# Altium schematic sheet esquematico.SchDoc
size A4; SheetNumber: 2; SheetTotal: 3
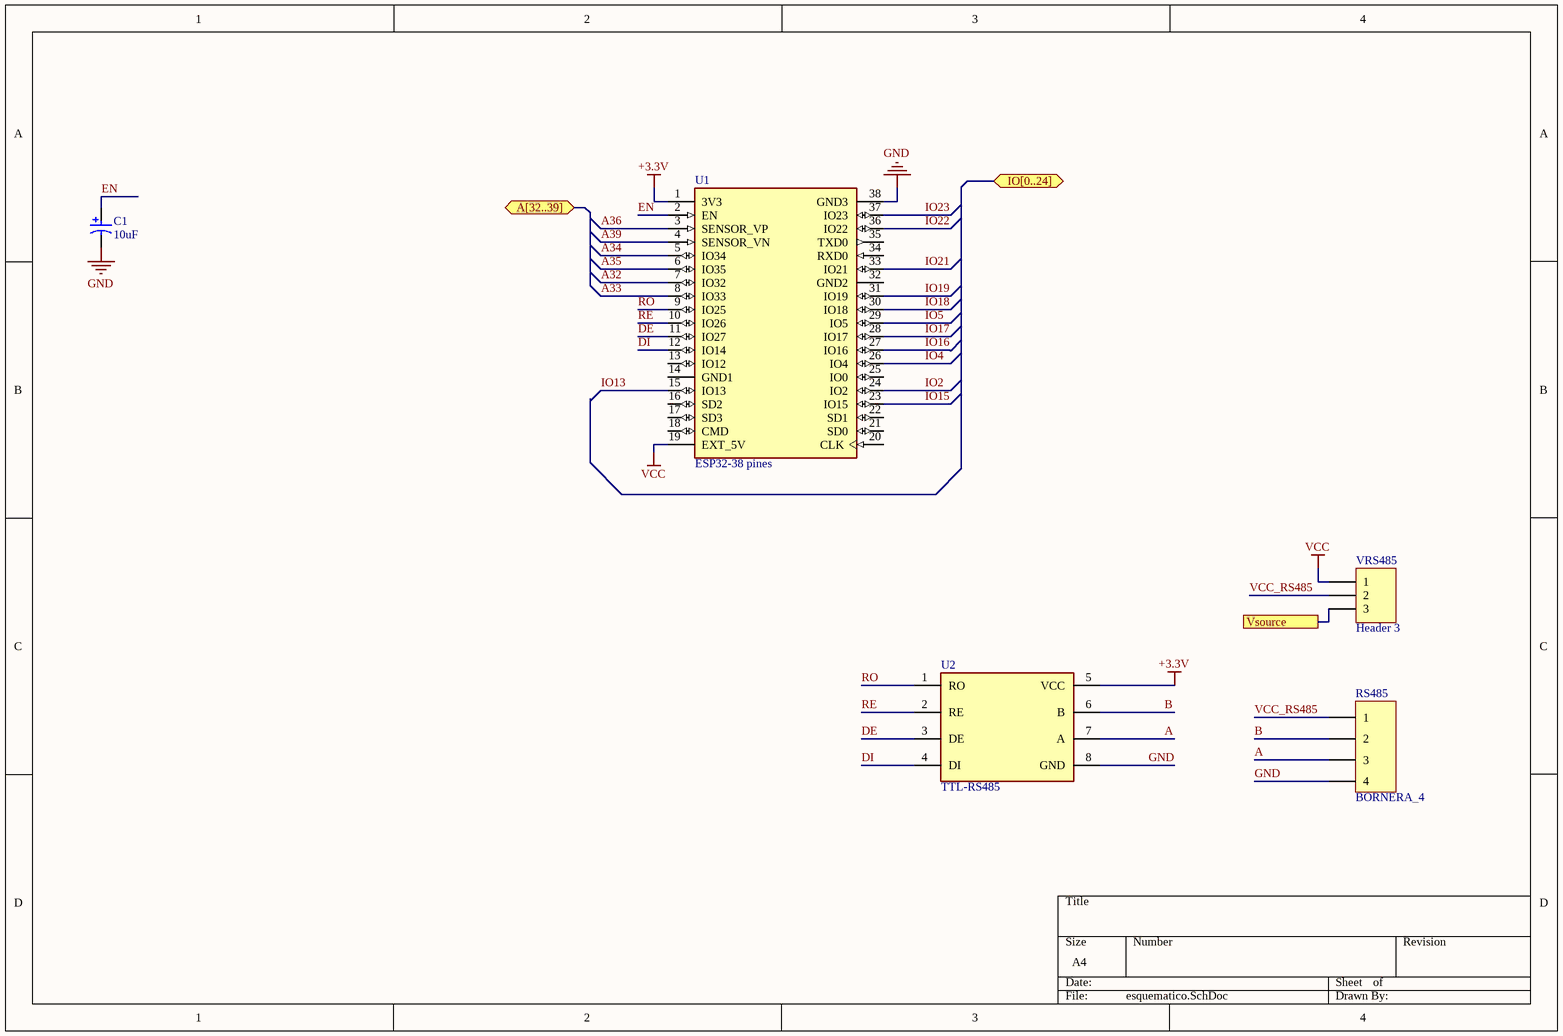
[diagram p0: esquematico.SchDoc]

## Parts
C1  10uF  [FP-CAPACITOR]
RS485  BORNERA_4  [BORNERA_4]
U1  ESP32-38 pines  [ESP32]
U2  TTL-RS485  [TTL_RS485]
VRS485  Header 3  [HDR1X3]

## Ports
A[32..39] (bidir), IO[0..24] (bidir), Vsource

## Nets
+3.3V: U1.1(3V3) U2.5(VCC)
GND: C1.2 RS485.4 U1.38(GND3) U2.8(GND)
VCC: U1.19(EXT_5V) VRS485.1
A: RS485.3 U2.7(A)
A32: U1.7(IO32)
A33: U1.8(IO33)
A34: U1.5(IO34)
A35: U1.6(IO35)
A36: U1.3(SENSOR_VP)
A39: U1.4(SENSOR_VN)
B: RS485.2 U2.6(B)
DE: U1.11(IO27) U2.3(DE)
DI: U1.12(IO14) U2.4(DI)
EN: C1.1 U1.2(EN)
IO2: U1.24(IO2)
IO4: U1.26(IO4)
IO5: U1.29(IO5)
IO13: U1.15(IO13)
IO15: U1.23(IO15)
IO16: U1.27(IO16)
IO17: U1.28(IO17)
IO18: U1.30(IO18)
IO19: U1.31(IO19)
IO21: U1.33(IO21)
IO22: U1.36(IO22)
IO23: U1.37(IO23)
RE: U1.10(IO26) U2.2(RE)
RO: U1.9(IO25) U2.1(RO)
VCC_RS485: RS485.1 VRS485.2
Vsource: VRS485.3 ; port Vsource

Not connected (* = marked no-connect by the designer): U1 13(IO12) 14(GND1) 16(SD2) 17(SD3) 18(CMD) 20(CLK) 21(SD0) 22(SD1) 25(IO0) 32(GND2) 34(RXD0) 35(TXD0)

## Library data of the parts
C1 = Electrolytic capacitor
VRS485 = Header 3: Header, 3-Pin; LatestRevisionDate: 17-Jul-2002; LatestRevisionNote: Re-released for DXP Platform.; Publisher: Altium Limited